# Altium schematic sheet Sheet3.SchDoc
size A4
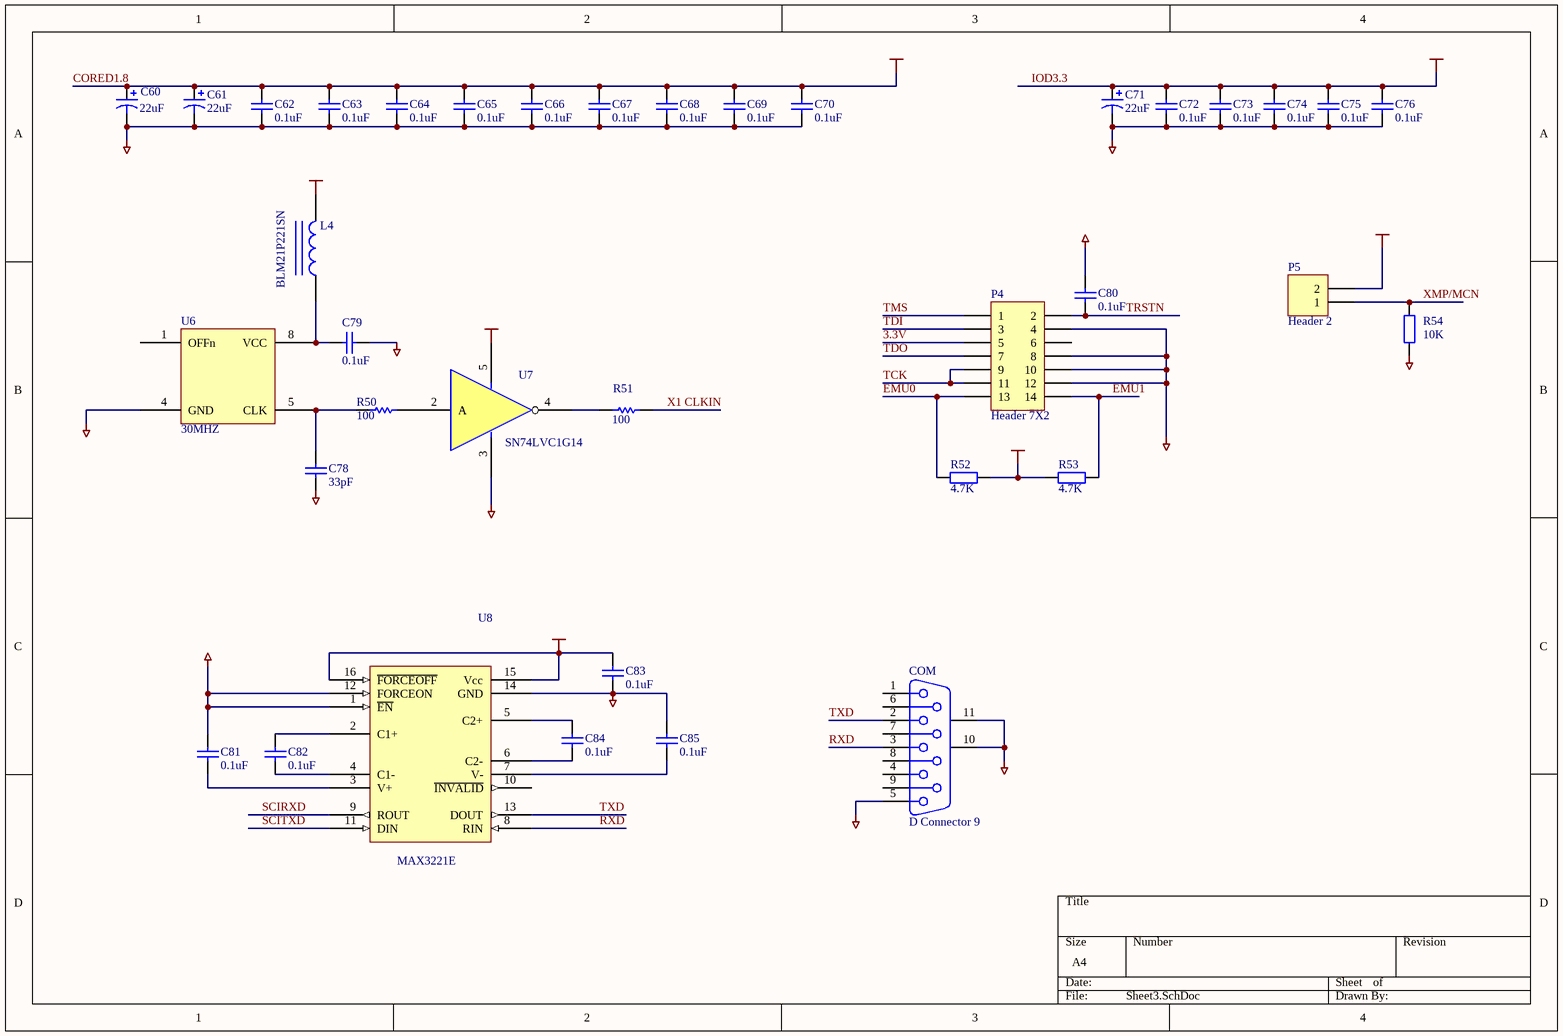
[diagram p0: Sheet3.SchDoc]

## Parts
C60  22uF  [CA2222-0350]
C61  22uF  [CA2222-0350]
C62  0.1uF  [CC2012-0805]
C63  0.1uF  [CC2012-0805]
C64  0.1uF  [CC2012-0805]
C65  0.1uF  [CC2012-0805]
C66  0.1uF  [CC2012-0805]
C67  0.1uF  [CC2012-0805]
C68  0.1uF  [CC2012-0805]
C69  0.1uF  [CC2012-0805]
C70  0.1uF  [CC2012-0805]
C71  22uF  [CA2222-0350]
C72  0.1uF  [CC2012-0805]
C73  0.1uF  [CC2012-0805]
C74  0.1uF  [CC2012-0805]
C75  0.1uF  [CC2012-0805]
C76  0.1uF  [CC2012-0805]
C78  33pF  [CC2012-0805]
C79  0.1uF  [CC2012-0805]
C80  0.1uF  [CC2012-0805]
C81  0.1uF  [CC2012-0805]
C82  0.1uF  [CC2012-0805]
C83  0.1uF  [CC2012-0805]
C84  0.1uF  [CC2012-0805]
C85  0.1uF  [CC2012-0805]
COM  D Connector 9  [DSUB1.385-2H9]
L4  BLM21P221SN  [CR2012-0805]
P4  Header 7X2  [HDR2X7]
P5  Header 2  [HDR1X2]
R50  100  [CR2012-0805]
R51  100  [CR2012-0805]
R52  4.7K  [CR2012-0805]
R53  4.7K  [CR2012-0805]
R54  10K  [CR2012-0805]
U6  30MHZ  [CR1525-4850]
U7  SN74LVC1G14  [SC-70]
U8  MAX3221E  [PW16]

## Nets
3.3V: C71.1 C72.2 C73.2 C74.2 C75.2 C76.2 C83.2 L4.2 P4.5 P5.2 R52.2 R53.1 U8.15(Vcc) U8.16(~{FORCEOFF})  [also labelled IOD3.3]
CORED1.8: C60.1 C61.1 C62.2 C63.2 C64.2 C65.2 C66.2 C67.2 C68.2 C69.2 C70.2 U7.5(VCC)  [also labelled 1.8V]
DGND: C60.2 C61.2 C62.1 C63.1 C64.1 C65.1 C66.1 C67.1 C68.1 C69.1 C70.1 C71.2 C72.1 C73.1 C74.1 C75.1 C76.1 C78.1 C79.2 C80.2 C81.2 C83.1 C85.2 COM.5 COM.10(MH1) COM.11(MH2) P4.4 P4.8 P4.10 P4.12 R54.1 U6.4(GND) U7.3(GND) U8.1(~{EN}) U8.12(FORCEON) U8.14(GND)
EMU0: P4.13 R52.1
EMU1: P4.14 R53.2
RXD: COM.3 U8.8(RIN)
SCIRXD: U8.9(ROUT)
SCITXD: U8.11(DIN)
TCK: P4.9 P4.11
TDI: P4.3
TDO: P4.7
TMS: P4.1
TRSTN: C80.1 P4.2
TXD: COM.2 U8.13(DOUT)
X1 CLKIN: R51.2
XMP/MCN: P5.1 R54.2
NetC78_2: C78.2 R50.1 U6.5(CLK)
NetC79_1: C79.1 L4.1 U6.8(VCC)
NetC81_1: C81.1 U8.3(V+)
NetC82_1: C82.1 U8.4(C1-)
NetC82_2: C82.2 U8.2(C1+)
NetC84_1: C84.1 U8.6(C2-)
NetC84_2: C84.2 U8.5(C2+)
NetC85_1: C85.1 U8.7(V-)
NetR50_2: R50.2 U7.2(A)
NetR51_1: R51.1 U7.4(Y)

Not connected (* = marked no-connect by the designer): COM 1 4 6 7 8 9; P4 6; U6 1(OFFn); U7 1(NC); U8 10(~{INVALID})

## Library data of the parts
C60 C61 C71 = Cap Pol3: Polarized Capacitor (Surface Mount); Published: 8-Jun-2000; LatestRevisionDate: 17-Jul-2002; LatestRevisionNote: Re-released for DXP Platform.; PackageReference: C0805; Publisher: Altium Limited
C62-C70 C72-C75 C79 C81-C85 = Cap Semi: Capacitor (Semiconductor SIM Model); Published: 8-Jun-2000; LatestRevisionDate: 17-Jul-2002; LatestRevisionNote: Re-released for DXP Platform.; PackageReference: C1206; Publisher: Altium Limited
C76 C78 C80 = Cap: Capacitor; Published: 8-Jun-2000; LatestRevisionDate: 17-Jul-2002; LatestRevisionNote: Re-released for DXP Platform.; Publisher: Altium Limited
COM = D Connector 9: Receptacle Assembly, 9 Position, Right Angle; PackageDocument: O; Positions: 9; Published: 15-Jun-2001; LatestRevisionDate: 17-Jul-2002; LatestRevisionNote: Re-released for DXP Platform.; DatasheetDocument: 1-Sep-1999; PackageReference: 788750; Publisher: Altium Limited; Orientation: Right Angle; Gender: Receptacle
L4 = Inductor Iron: Magnetic-Core Inductor; Published: 24-Mar-1999; LatestRevisionDate: 17-Jul-2002; LatestRevisionNote: Re-released for DXP Platform.; Publisher: Altium Limited
P4 = Header 7X2: Header, 7-Pin, Dual row; LatestRevisionDate: 17-Jul-2002; LatestRevisionNote: Re-released for DXP Platform.; Publisher: Altium Limited
P5 = Header 2: Header, 2-Pin; LatestRevisionDate: 17-Jul-2002; LatestRevisionNote: Re-released for DXP Platform.; Publisher: Altium Limited
R50 R51 = Res1: Resistor; Published: 8-Jun-2000; LatestRevisionDate: 17-Jul-2002; LatestRevisionNote: Re-released for DXP Platform.; Publisher: Altium Limited
R52-R54 = Res2: Resistor; Published: 8-Jun-2000; LatestRevisionDate: 17-Jul-2002; LatestRevisionNote: Re-released for DXP Platform.; Publisher: Altium Limited
U6 = Crystal: 有源晶振